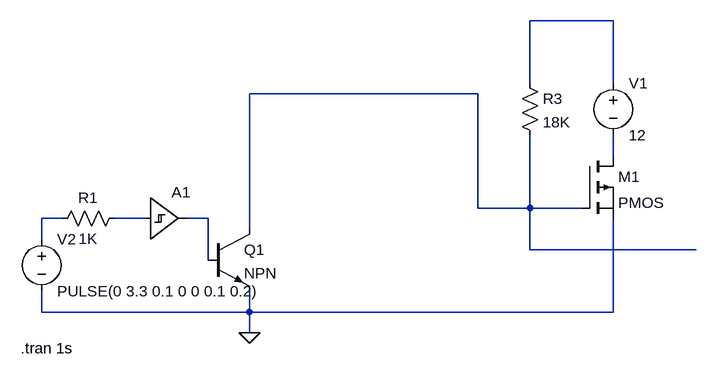
[diagram p0: schematic MK1.2.asc]
MK1.2.asc, the LTspice schematic file:
Version 4
SHEET 1 880 680
WIRE 592 -128 464 -128
WIRE 464 -32 464 -128
WIRE 592 -32 592 -128
WIRE 384 -16 32 -16
WIRE 592 80 592 48
WIRE 384 160 384 -16
WIRE 464 160 464 48
WIRE 464 160 384 160
WIRE 544 160 464 160
WIRE -256 176 -288 176
WIRE -128 176 -176 176
WIRE -32 176 -64 176
WIRE 32 192 32 -16
WIRE -288 208 -288 176
WIRE 464 224 464 160
WIRE 720 224 464 224
WIRE -32 240 -32 176
WIRE -288 320 -288 288
WIRE 32 320 32 288
WIRE 32 320 -288 320
WIRE 592 320 592 176
WIRE 592 320 32 320
WIRE 32 352 32 320
FLAG 32 352 0
SYMBOL npn -32 192 R0
SYMATTR InstName Q1
SYMBOL voltage 592 -48 R0
WINDOW 123 0 0 Left 2
WINDOW 39 0 0 Left 2
SYMATTR InstName V1
SYMATTR Value 12
SYMBOL res 448 -48 R0
SYMATTR InstName R3
SYMATTR Value 18K
SYMBOL pmos 544 80 R0
SYMATTR InstName M1
SYMBOL voltage -288 192 R0
WINDOW 123 0 0 Left 2
WINDOW 39 0 0 Left 2
SYMATTR InstName V2
SYMATTR Value PULSE(0 3.3 0.1 0 0 0.1 0.2)
SYMBOL res -160 160 R90
WINDOW 0 0 56 VBottom 2
WINDOW 3 32 56 VTop 2
SYMATTR InstName R1
SYMATTR Value 1K
SYMBOL Digital\\schmtbuf -128 112 R0
SYMATTR InstName A1
TEXT -320 376 Left 2 !.tran 1s

The netlist it stands for:
* MK1.2.asc
Q1 N002 N006 0 0 NPN
V1 N001 N003 12
R3 N001 N002 18K
M1 N003 N002 0 0 PMOS
V2 N004 0 PULSE(0 3.3 0.1 0 0 0.1 0.2)
R1 N005 N004 1K
A1 N005 0 0 0 0 0 N006 0 SCHMITT
.model NPN NPN
.model PNP PNP
.lib standard.bjt
.model NMOS NMOS
.model PMOS PMOS
.lib standard.mos
.tran 1s
.backanno
.end